# EAGLE schematic VolcanoHat (EAGLE 9.0.1)
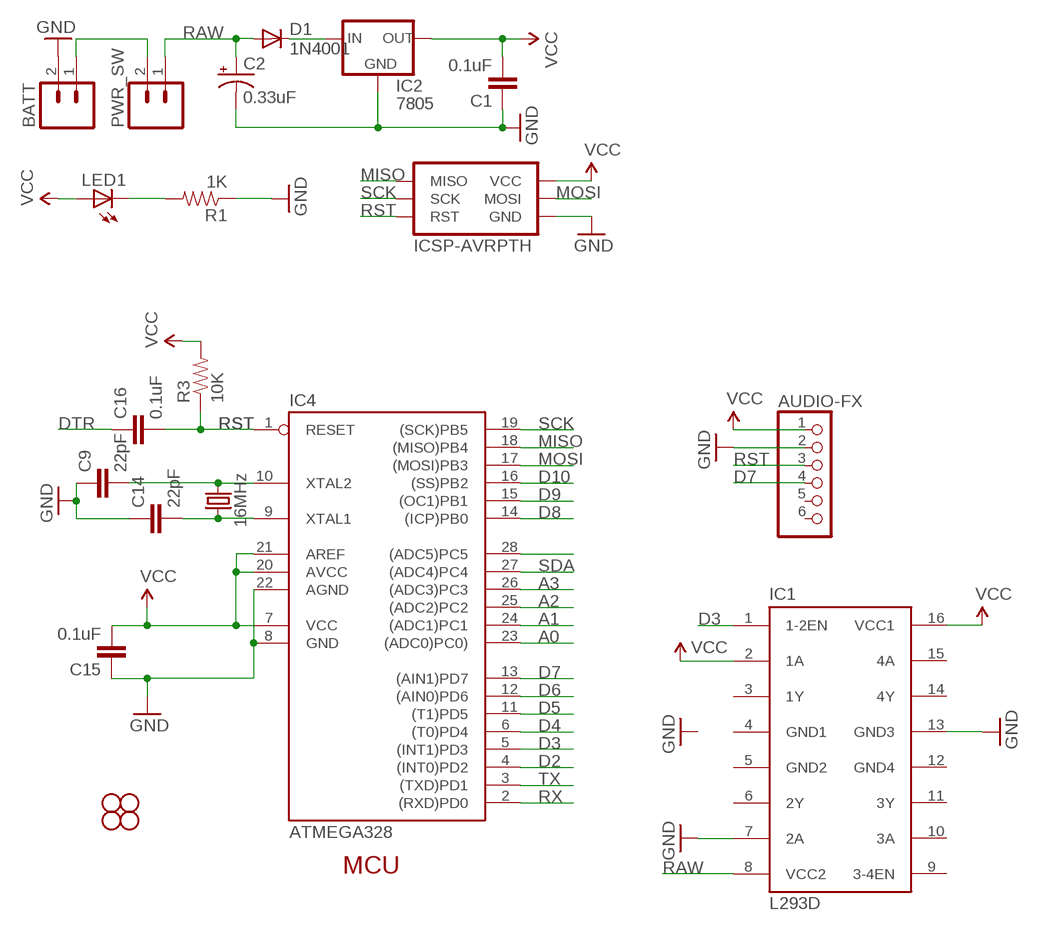
[diagram p0: schematic, sheet 1]

## Parts
AUDIO-FX  PINHD-1X6  [1X06]
BATT  M02LOCK_LONGPADS  [1X02_LOCK_LONGPADS]
C1  0.1uF  CAPPTH2  [CAP-PTH-SMALL2]
C2  0.33uF  CAP_POLPTH2  [CPOL-RADIAL-10UF-25V]
C9  22pF  CAPPTH2  [CAP-PTH-SMALL2]
C14  22pF  CAPPTH2  [CAP-PTH-SMALL2]
C15  0.1uF  CAPPTH2  [CAP-PTH-SMALL2]
C16  0.1uF  CAPPTH2  [CAP-PTH-SMALL2]
D1  1N4001  DIODEPTH  [DIODE-1N4001]
IC1  L293D  [DIL16]
IC2  7805  V_REG_78XXSINK  [TO220-IGO]
IC4  ATMEGA328  AT90S4433P  [DIL28-3]
ICSP  ICSP-AVRPTH  [2X3-SHROUDED]
JP1  STAND-OFF#2  [STAND-OFF-#2]
JP2  STAND-OFF#2  [STAND-OFF-#2]
JP5  STAND-OFF#2  [STAND-OFF-#2]
JP6  STAND-OFF#2  [STAND-OFF-#2]
LED1  LED5MM  [LED5MM]
PWR_SW  M02LOCK_LONGPADS  [1X02_LOCK_LONGPADS]
R1  1K  RESISTORAXIAL-0.3  [AXIAL-0.3]
R3  10K  RESISTORAXIAL-0.3  [AXIAL-0.3]
Y1  16MHz  CRYSTALHC49US  [HC49US]

## Nets
A0: IC4.23((ADC0)PC0))
A1: IC4.24((ADC1)PC1)
A2: IC4.25((ADC2)PC2)
A3: IC4.26((ADC3)PC3)
D2: IC4.4((INT0)PD2)
D3: IC1.1(1-2EN) IC4.5((INT1)PD3)
D4: IC4.6((T0)PD4)
D5: IC4.11((T1)PD5)
D6: IC4.12((AIN0)PD6)
D7: AUDIO-FX.4 IC4.13((AIN1)PD7)
D8: IC4.14((ICP)PB0)
D9: IC4.15((OC1)PB1)
D10: IC4.16((SS)PB2)
DTR: C16.1
GND [power]: AUDIO-FX.2 BATT.2 C1.1 C2.2(-) C9.1 C14.1 C15.1 IC1.7(2A) IC1.13(GND3) IC2.GND IC4.8(GND) IC4.22(AGND) ICSP.6(GND) R1.P$1
MISO: IC4.18((MISO)PB4) ICSP.1(MISO)
MOSI: IC4.17((MOSI)PB3) ICSP.4(MOSI)
N$1: LED1.K(C) R1.P$2
N$2: BATT.1 PWR_SW.2
N$5: IC4.28((ADC5)PC5)
N$6 [power]: D1.C IC2.IN
RAW [power]: C2.1(+) D1.A IC1.8(VCC2) PWR_SW.1
RST: AUDIO-FX.3 C16.2 IC4.1(RESET) ICSP.5(RST) R3.P$1
RX: IC4.2((RXD)PD0)
SCK: IC4.19((SCK)PB5) ICSP.3(SCK)
SDA: IC4.27((ADC4)PC4)
TX: IC4.3((TXD)PD1)
VCC [power]: AUDIO-FX.1 C1.2 C15.2 IC1.2(1A) IC1.16(VCC1) IC2.OUT IC4.7(VCC) IC4.20(AVCC) IC4.21(AREF) ICSP.2(VCC) LED1.A R3.P$2
XTAL1: C14.2 IC4.9(XTAL1) Y1.1
XTAL2: C9.2 IC4.10(XTAL2) Y1.2
Unconnected: AUDIO-FX.5 AUDIO-FX.6 IC1.3(1Y) IC1.6(2Y) IC1.9(3-4EN) IC1.10(3A) IC1.11(3Y) IC1.14(4Y) IC1.15(4A)

## Notes on the sheet
- MCU

## Power pins joined to a net without a drawn wire
GND1: IC1.4(GND1)
GND2: IC1.5(GND2)
GND4: IC1.12(GND4)

## Library data of the parts
AUDIO-FX = adafruit:PINHD-1X6: PIN HEADER
BATT PWR_SW = Dek:M02: Header 2 Standard 2-pin 0.1" header. Use with straight break away headers (SKU : PRT-00116), right angle break away headers (PRT-00553), swiss pins (PRT-00743), machine pins (PRT-00117), and female headers (PRT-00115). Molex polarized connector foot print use with SKU : PRT-08233 with associated crimp pins and housings.
C1 C9 C14-C16 = Dek:CAP: Capacitor Standard 0603 ceramic capacitor, and 0.1" leaded capacitor.
C2 = Dek:CAP_POL: Capacitor Polarized These are standard SMD and PTH capacitors. Normally 10uF, 47uF, and 100uF in electrolytic and tantalum varieties. Always verify the external diameter of the through hole cap, it varies with capacity, voltage, and manufacturer. The EIA devices should be standard.
D1 = Dek:DIODE: Diode These are standard reverse protection diodes and small signal diodes. SMA package can handle up to about 1A. SOD-323 can handle about 200mA. What the SOD-323 package when ordering, there are some mfgs out there that are 5-pin packages.
IC1 = st-microelectronics:L293D: PUSH-PULL 4 CHANNEL DRIVER
IC2 = Dek:V_REG_78XX: Voltage Regulator Standard 7805 5V regulator. IGO (Input Ground Output). Spark Fun Electronics SKU : COM-00107
IC4 = Dek:AT90S4433: MICROCONTROLLER 4 Kbytes FLASH 128 bytes SRAM 256 bytes EEPROM UART 6-channel 10 bit ADC; OC_FARNELL: unknown; OC_NEWARK: unknown
ICSP = Dek:ICSP-AVR
JP1 JP2 JP5 JP6 = Dek:STAND-OFF: Stand Off This is the mechanical footprint for a #2 phillips button head screw. Use the keepout ring to avoid running the screw head into surrounding components.
LED1 = Dek:LED: LEDs Standard schematic elements and footprints for 5mm, 3mm, 1206, and 0603 sized LEDs. 5mm - Spark Fun Electronics SKU : COM-00529 (and others)
R1 R3 = Dek:RESISTOR: Resistor Basic schematic elements and footprints for 0603, 1206, and PTH resistors.
Y1 = Dek:CRYSTAL: Various standard crystals. Proven footprints. Spark Fun Electronics SKU : COM-00534

## Net classes
1 power: width 0.305 mm, clearance 0.305 mm
2 old_power: width 0.813 mm, clearance 0.508 mm